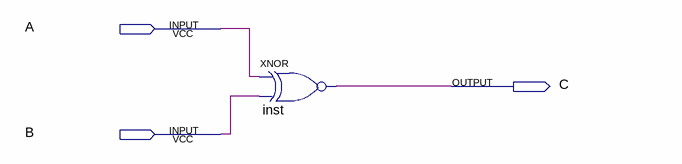
[diagram p0: schematic sheet]
// Quartus schematic XORTESTE.bdf as structural Verilog: 1 symbols, 3 pins
module XORTESTE (
  input  A,
  input  B,
  output C
);

  xnor inst (C, A, B);
endmodule
